# EasyEDA Pro project HandyPico.epro, board PCB1
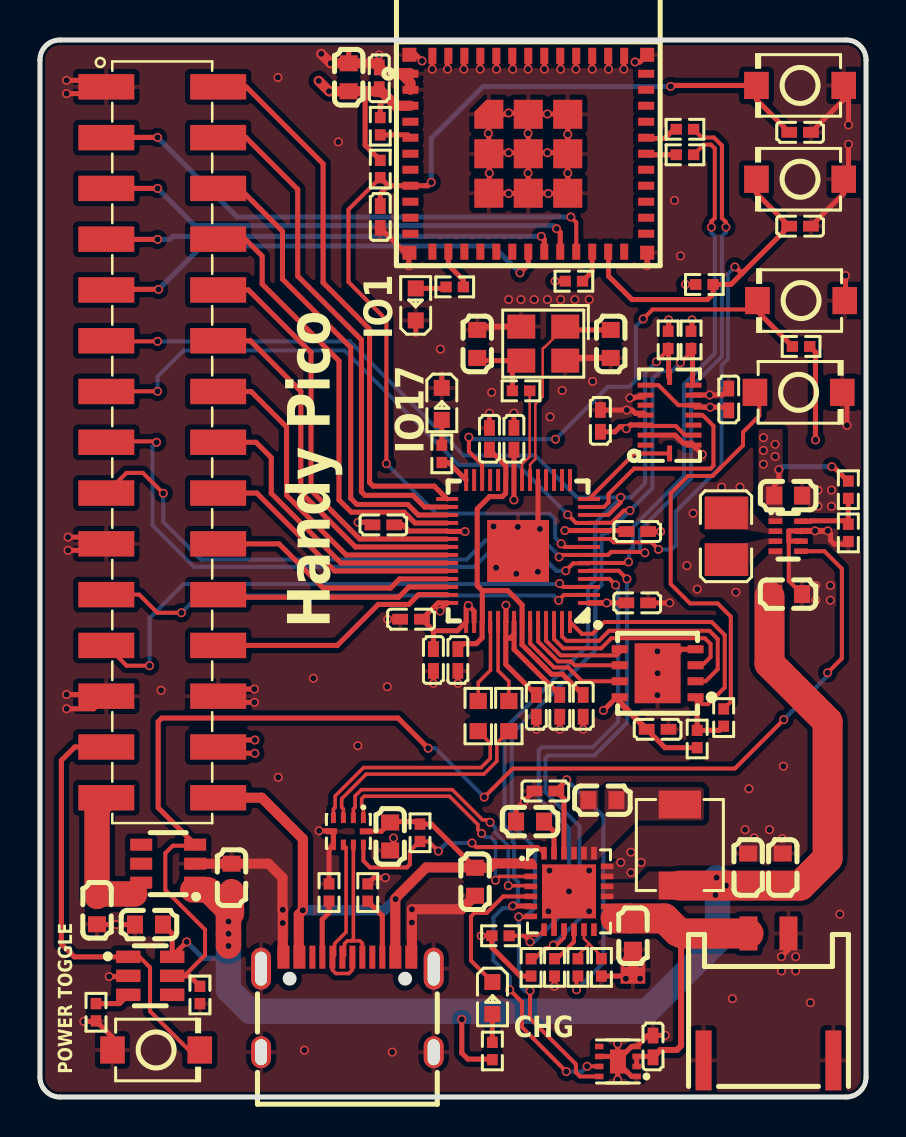
[diagram p1: board, top side]
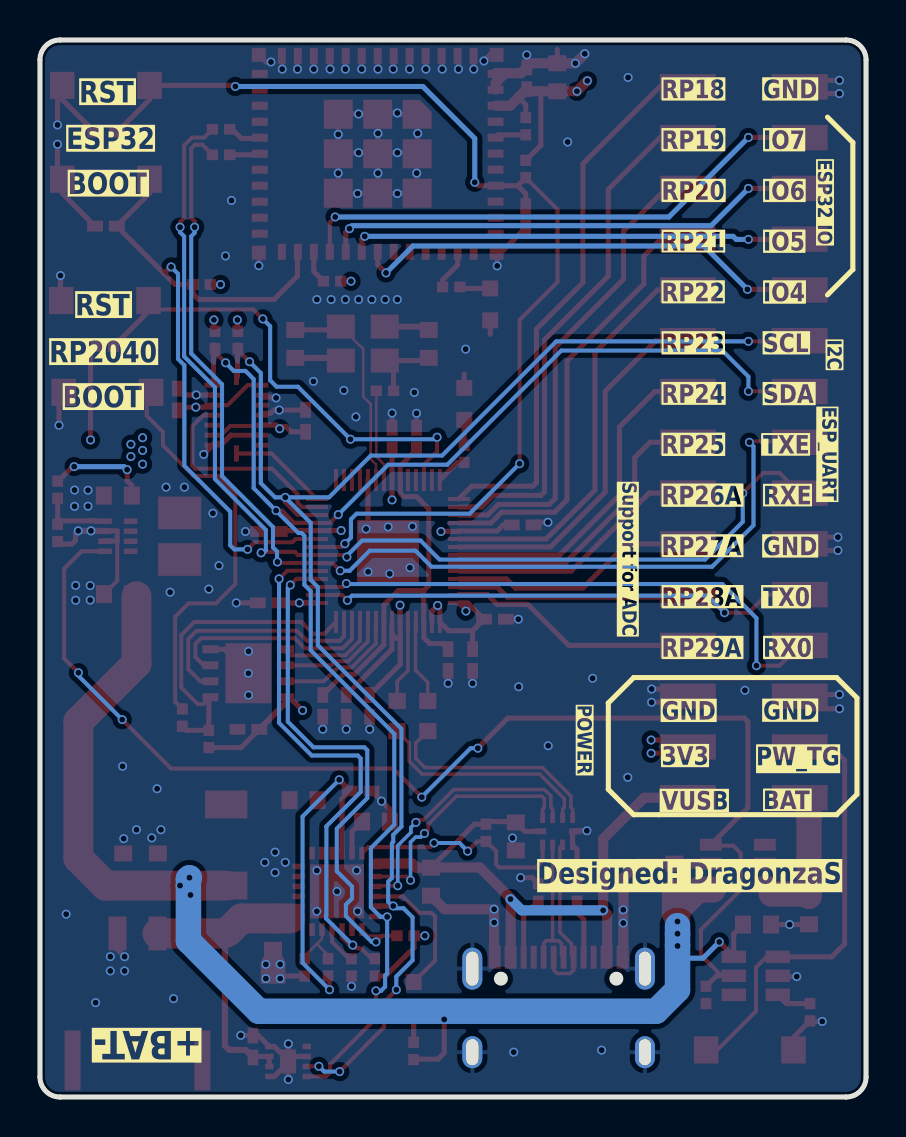
[diagram p2: board, bottom side, seen from below]

Outline 41.35 x 52.87 mm; copper layers: Top Layer, Inner1, Inner2, Bottom Layer. Coordinates in mm from the lower left corner of the outline.
Outline path: 0,51.87 0,1 arc(0.29,0.29) 1,0 40.35,0 arc(41.06,0.29) 41.35,1 41.35,51.87 arc(41.06,52.58) 40.35,52.87 1,52.87 arc(0.29,52.58) 0,51.87
Stack: Top Layer 0.035mm Outer layer thickness 1oz / Dielectric1 0.2104mm 7628 RC49% 8.6mil / Inner1 0.0152mm Inner layer thickness / Dielectric2 1.065mm 1.1mm H/HOZ Copper / Inner2 0.0152mm Inner layer thickness / Dielectric3 0.2104mm 7628 RC49% 8.6mil / Bottom Layer 0.035mm Outer layer thickness 1oz

## Design rules (mm)
template: Custom Config
spacing copperThickness1oz (default): track to track 0.102, other pairs 0.15 to 0.3
spacing copperThickness2oz: track to track 0.203, other pairs 0.152 to 0.3
spacing copperThicknessInner0.5oz: track to track 0.089, other pairs 0.152 to 0.3
track width copperThickness1oz (default): min 0.102, default 0.254, max 2.54
track width copperThickness2oz: min 0.203, default 0.254, max 2.54
track width copperThickness0.5oz: min 0.089, default 0.254, max 2.54
differential pair differentialPair (default): width min 0.127, default 0.254, max 2.54; gap min 0.152, default 0.152
via viaSize (default): diameter min 0.4, default 0.61, max 10; hole min 0.3, default 0.305, max 6.3

## Placement (name value [footprint] x y rotation side)
C1  4.7uF  [C0402]  25.3 15.31 0 top
C2  100nF  [C0402]  38.05 48.25 0 top
C3  100nF  [C0402]  38.05 43.56 0 top
C4  47nF  [C0603]  28.15 14.85 0 top
C5  10uF  [C0603]  35.45 11.48 270 top
C6  10uF  [C0603]  37.18 11.48 270 top
C7  22uF  [C0603]  15.45 51.01 270 top
C8  100nF  [C0402]  16.98 50.96 270 top
C9  1uF  [C0603]  21.78 10.77 90 top
C10  22uF  [C0603]  24.53 13.78 0 top
C12  10uF  [C0603]  29.68 8.06 90 top
C14  100nF  [C0402]  30.69 2.53 270 top
C15  22uF  [C0603]  37.44 25.16 180 top
C16  47uF  [C0603]  37.45 30.08 180 top
C17  10uF  [C0603]  5.46 8.63 180 top
C18  10uF  [C0603]  9.59 10.97 90 top
C19  10uF  [C0603]  17.53 13.03 90 top
C20  1uF  [C0603]  2.86 9.34 90 top
C21  100nF  [C0402]  23.72 32.93 270 top
C22  100nF  [C0402]  18.57 23.9 0 top
C23  100nF  [C0402]  17.19 28.62 0 top
C24  100nF  [C0402]  29.89 28.29 180 top
C25  100nF  [C0402]  29.89 24.72 180 top
C26  100nF  [C0402]  26.02 19.56 90 top
C27  100nF  [C0402]  24.85 19.56 90 top
C28  100nF  [C0402]  27.19 19.56 90 top
C29  100nF  [C0402]  22.5 32.93 270 top
C30  1uF  [C0402]  19.69 21.86 90 top
C31  1uF  [C0402]  20.92 21.86 90 top
C32  100nF  [C0402]  30.91 18.39 180 top
C33  100nF  [C0402]  28.05 33.82 270 top
C34  100nF  [C0402]  34.48 34.89 270 top
C35  15pF  [C0603]  28.57 37.67 270 top
C36  15pF  [C0603]  21.89 37.67 270 top
C37  1uF  [C0402]  17.03 44.02 90 top
CN1  PH-2P卧贴  [CONN-SMD_2P-P2.00_PH2.0-SPWB]  36.47 5 180 top
L1  1.5uH  [IND-SMD_L4.4-W4.2]  32.03 12.6 90 top
L2  1uH  [L1008]  34.35 28.05 90 top
LED1  KT-0603R  [LED0603-RD]  22.64 4.95 270 top
LED2  KT-0603R  [LED0603-RD]  18.81 39.65 90 top
LED3  KT-0603R  [LED0603-RD]  20.11 34.67 270 top
NOREF  -  [Pad_e210]  29.68 6.36 0 top
R1  330Ω  [R0402]  22.64 2.3 90 top
R2  10kΩ  [R0402]  26.93 6.48 270 top
R3  10kΩ  [R0402]  28.1 6.48 90 top
R7  10kΩ  [R0402]  23.05 8.06 180 top
R8  10kΩ  [R0402]  24.58 6.48 270 top
R9  470Ω  [R0402]  25.76 6.48 90 top
R11  511kΩ  [R0402]  40.46 30.38 90 top
R12  91kΩ  [R0402]  40.46 28.22 90 top
R13  10kΩ  [R0402]  19.02 13.22 270 top
R14  5.1kΩ  [R0402]  16.41 10.23 90 top
R15  10kΩ  [R0402]  2.8 4.24 90 top
R16  5.1kΩ  [R0402]  14.47 10.23 90 top
R17  4.7kΩ  [R0402]  31.44 37.87 90 top
R18  4.7kΩ  [R0402]  32.59 37.87 90 top
R19  27Ω  [R0603]  23.47 19.05 270 top
R20  27Ω  [R0603]  21.94 19.05 270 top
R21  1kΩ  [R0402]  34.22 18.98 270 top
R22  10kΩ  [R0402]  32.9 17.91 90 top
R23  10kΩ  [R0402]  38.1 37.54 0 top
R24  1kΩ  [R0402]  24.08 35.32 180 top
R25  5.1kΩ  [R0402]  8.01 5.11 90 top
R26  10kΩ  [R0402]  17.03 46.42 90 top
R27  10kΩ  [R0402]  33.26 40.64 0 top
R28  330Ω  [R0402]  32.28 48.41 0 top
R29  330Ω  [R0402]  32.28 47.13 0 top
R30  10kΩ  [R0402]  17.03 48.56 270 top
R31  10kΩ  [R0402]  26.72 40.81 0 top
R32  330Ω  [R0402]  20.76 40.52 180 top
R33  330Ω  [R0402]  20.12 32.17 90 top
SW1  TS-1088-AR02016  [SW-SMD_L3.9-W3.0-P4.45]  38.05 50.6 180 top
SW2  TS-1088-AR02016  [SW-SMD_L3.9-W3.0-P4.45]  38.05 45.91 180 top
SW3  TS-1088-AR02016  [SW-SMD_L3.9-W3.0-P4.45]  37.97 35.25 0 top
SW4  TS-1088-AR02016  [SW-SMD_L3.9-W3.0-P4.45]  38.1 39.84 180 top
SW5  TS-1088-AR02016  [SW-SMD_L3.9-W3.0-P4.45]  5.81 2.35 0 top
U1  BQ25895RTWR  [QFN-24_L4.0-W4.0-P0.50-TL-EP2.7]  26.48 10.28 0 top
U3  MAX17048G+T10  [TDFN-8_L2.0-W2.0-P0.50-BL-EP1.2]  28.93 1.78 90 top
U4  TPS631000DRLR  [SOT-583-8_L2.1-W1.2-P0.50-LS1.6-BL]  37.45 28.05 270 top
U5  MAX16054AZT+T  [TSOT-23-6_L2.9-W1.6-P0.95-LS2.8-TL]  5.52 6.06 0 top
U6  TPS22918DBVR  [SOT-23-6_L2.9-W1.6-P0.95-LS2.8-BR]  6.42 11.67 0 top
U9  RP2040  [LQFN-56_L7.0-W7.0-P0.4-EP]  23.93 27.31 180 top
U10  W25Q64JVXGIQ  [XSON-8_L4.0-W4.0-P0.80-TL-EP]  30.91 21.2 180 top
U11  BMI088  [LGA-16_L4.5-W3.0-P0.50-BL]  31.51 34.11 0 top
U12  ABM8-272-T3  [CRYSTAL-SMD_4P-L3.2-W2.5-BL]  25.19 37.68 180 top
U14  TS3USB221ARSER  [UQFN-10_L2.0-W1.5-P0.50-BL]  15.44 13.29 180 top
U15  ESP32-C3-MINI-1-N4  [WIFIM-SMD_ESP32-C3-MINI-1]  24.44 47.18 0 top
U17  HB-PH9-254215PB2GOP  [HDR-SMD_30P-P2.54-V-M-R2-C15-S7.4]  6.12 32.75 270 top
USB1  HC-TYPE-C-16P-01A-R  [USB-C-SMD_G-SWITCH_GT-USB-7010EN]  15.39 4.62 0 top

## Footprints (pads in the part's own frame, mm; a bottom-side part is the same pattern mirrored in y, then rotated)
C0402
  rect 0.79x0.54 smd: 1(-0.545,0) 2(0.545,0)
C0603
  rect 0.8x0.9 smd: 1(-0.7,0) 2(0.7,0)
CONN-SMD_2P-P2.00_PH2.0-SPWB
  rect 0.9x1.7 smd: 1(1,-3.175) 2(-1,-3.175)
  rect 0.8x3 smd: 3(-3.25,3.175) 4(3.25,3.175)
CRYSTAL-SMD_4P-L3.2-W2.5-BL
  rect 1.4x1.2 smd: 1(-1.1,-0.85) 2(1.1,-0.85) 3(1.1,0.85) 4(-1.1,0.85)
HDR-SMD_30P-P2.54-V-M-R2-C15-S7.4
  rect 1.27x2.8 smd: 1(-17.78,-2.8) 2(-17.78,2.8) 3(-15.24,-2.8) 4(-15.24,2.8) 5(-12.7,-2.8) 6(-12.7,2.8) 7(-10.16,-2.8) 8(-10.16,2.8) 9(-7.62,-2.8) 10(-7.62,2.8) 11(-5.08,-2.8) 12(-5.08,2.8) 13(-2.54,-2.8) 14(-2.54,2.8) 15(0,-2.8) 16(0,2.8) 17(2.54,-2.8) 18(2.54,2.8) 19(5.08,-2.8) 20(5.08,2.8) 21(7.62,-2.8) 22(7.62,2.8) 23(10.16,-2.8) 24(10.16,2.8) 25(12.7,-2.8) 26(12.7,2.8) 27(15.24,-2.8) 28(15.24,2.8) 29(17.78,-2.8) 30(17.78,2.8)
IND-SMD_L4.4-W4.2
  rect 1.4x2.12 smd: 1(2.028,0) 2(-2.028,0)
L1008
  rect 1.635x2.16 smd: 1(-1.167,0) 2(1.167,0)
LED0603-RD
  rect 0.8x0.8 smd: 1(-0.799,0) 2(0.799,0)
LGA-16_L4.5-W3.0-P0.50-BL
  rect 0.8x0.25 smd: 1(-1.2,-1.498) 2(-1.2,-0.998) 3(-1.2,-0.498) 4(-1.2,0.002) 5(-1.2,0.502) 6(-1.2,1.002) 7(-1.2,1.502) 9(1.2,1.502) 10(1.2,1.002) 11(1.2,0.502) 12(1.2,0.002) 13(1.2,-0.498) 14(1.2,-0.998) 15(1.2,-1.498)
  rect 0.25x0.8 smd: 8(0,1.915) 16(0,-1.915)
LQFN-56_L7.0-W7.0-P0.4-EP
  rect 1.1x0.2 smd: 1(-3.55,2.6) 2(-3.55,2.2) 3(-3.55,1.8) 4(-3.55,1.4) 5(-3.55,1) 6(-3.55,0.6) 7(-3.55,0.2) 8(-3.55,-0.2) 9(-3.55,-0.6) 10(-3.55,-1) 11(-3.55,-1.4) 12(-3.55,-1.8) 13(-3.55,-2.2) 14(-3.55,-2.6) 29(3.55,-2.6) 30(3.55,-2.2) 31(3.55,-1.8) 32(3.55,-1.4) 33(3.55,-1) 34(3.55,-0.6) 35(3.55,-0.2) 36(3.55,0.2) 37(3.55,0.6) 38(3.55,1) 39(3.55,1.4) 40(3.55,1.8) 41(3.55,2.2) 42(3.55,2.6)
  rect 0.2x1.1 smd: 15(-2.6,-3.55) 16(-2.2,-3.55) 17(-1.8,-3.55) 18(-1.4,-3.55) 19(-1,-3.55) 20(-0.6,-3.55) 21(-0.2,-3.55) 22(0.2,-3.55) 23(0.6,-3.55) 24(1,-3.55) 25(1.4,-3.55) 26(1.8,-3.55) 27(2.2,-3.55) 28(2.6,-3.55) 43(2.6,3.55) 44(2.2,3.55) 45(1.8,3.55) 46(1.4,3.55) 47(1,3.55) 48(0.6,3.55) 49(0.2,3.55) 50(-0.2,3.55) 51(-0.6,3.55) 52(-1,3.55) 53(-1.4,3.55) 54(-1.8,3.55) 55(-2.2,3.55) 56(-2.6,3.55)
  rect 3.1x3.1 smd: 57(0,0)
Pad_e210
  custom 1.239x1.377 smd: 69(0,0)
QFN-24_L4.0-W4.0-P0.50-TL-EP2.7
  rect 0.633x0.28 smd: 1(-1.911,1.25) 2(-1.911,0.75) 3(-1.911,0.25) 4(-1.911,-0.25) 5(-1.911,-0.75) 6(-1.911,-1.25) 13(1.911,-1.25) 14(1.911,-0.75) 15(1.911,-0.25) 16(1.911,0.25) 17(1.911,0.75) 18(1.911,1.25)
  rect 0.28x0.633 smd: 7(-1.25,-1.911) 8(-0.75,-1.911) 9(-0.25,-1.911) 10(0.25,-1.911) 11(0.75,-1.911) 12(1.25,-1.911) 19(1.25,1.911) 20(0.75,1.911) 21(0.25,1.911) 22(-0.25,1.911) 23(-0.75,1.911) 24(-1.25,1.911)
  rect 2.7x2.7 smd: 25(0,0)
R0402
  rect 0.566x0.54 smd: 1(-0.433,0) 2(0.433,0)
R0603
  rect 0.806x0.864 smd: 1(-0.753,0) 2(0.753,0)
SOT-23-6_L2.9-W1.6-P0.95-LS2.8-BR
  rect 1.1x0.6 smd: 1(1.35,-0.95) 2(1.35,0) 3(1.35,0.95) 4(-1.35,0.95) 5(-1.35,0) 6(-1.35,-0.95)
SOT-583-8_L2.1-W1.2-P0.50-LS1.6-BL
  rect 0.28x0.68 smd: 1(-0.75,-0.64) 2(-0.25,-0.64) 3(0.25,-0.64) 4(0.75,-0.64) 5(0.75,0.64) 6(0.25,0.64) 7(-0.25,0.64) 8(-0.75,0.64)
SW-SMD_L3.9-W3.0-P4.45
  rect 1.23x1.36 smd: 1(-2.185,0) 2(2.185,0)
TDFN-8_L2.0-W2.0-P0.50-BL-EP1.2
  rect 0.28x0.425 smd: 1(-0.75,-0.938) 2(-0.25,-0.938) 3(0.25,-0.938) 4(0.75,-0.938) 5(0.75,0.938) 6(0.25,0.938) 7(-0.25,0.938) 8(-0.75,0.938)
  rect 1.2x0.8 smd: 9(0,0)
TSOT-23-6_L2.9-W1.6-P0.95-LS2.8-TL
  rect 1.219x0.623 smd: 1(-1.1,0.95) 2(-1.1,0) 3(-1.1,-0.95) 4(1.1,-0.95) 5(1.1,0) 6(1.1,0.95)
UQFN-10_L2.0-W1.5-P0.50-BL
  rect 0.25x0.525 smd: 1(-0.75,-0.675) 2(-0.25,-0.675) 3(0.25,-0.675) 4(0.75,-0.675) 6(0.75,0.675) 7(0.25,0.675) 8(-0.25,0.675) 9(-0.75,0.675)
  rect 0.58x0.3 smd: 5(0.86,0) 10(-0.86,0)
USB-C-SMD_G-SWITCH_GT-USB-7010EN
  oval 1x2.1 hole 0.6x1.7: 1(-4.32,1.802) 2(4.32,1.802)
  oval 1x1.6 hole 0.6x1.3: 3(4.32,-2.377) 4(-4.32,-2.377)
  rect 0.6x1.15 smd: A1B12(-3.2,2.377) A4B9(-2.4,2.377) B1A12(3.2,2.377) B4A9(2.4,2.377)
  rect 0.3x1.15 smd: A5(-1.25,2.377) A6(-0.25,2.377) A7(0.25,2.377) A8(1.25,2.377) B5(1.75,2.377) B6(0.75,2.377) B7(-0.75,2.377) B8(-1.75,2.377)
WIFIM-SMD_ESP32-C3-MINI-1
  rect 0.8x0.4 smd: 1(-5.9,4) 2(-5.9,3.2) 3(-5.9,2.4) 4(-5.9,1.6) 5(-5.9,0.8) 6(-5.9,0) 7(-5.9,-0.8) 8(-5.9,-1.6) 9(-5.9,-2.4) 10(-5.9,-3.2) 11(-5.9,-4) 25(5.9,-4) 26(5.9,-3.2) 27(5.9,-2.4) 28(5.9,-1.6) 29(5.9,-0.8) 30(5.9,0) 31(5.9,0.8) 32(5.9,1.6) 33(5.9,2.4) 34(5.9,3.2) 35(5.9,4)
  rect 0.4x0.8 smd: 12(-4.8,-4.9) 13(-4,-4.9) 14(-3.2,-4.9) 15(-2.4,-4.9) 16(-1.6,-4.9) 17(-0.8,-4.9) 18(0,-4.9) 19(0.8,-4.9) 20(1.6,-4.9) 21(2.4,-4.9) 22(3.2,-4.9) 23(4,-4.9) 24(4.8,-4.9) 36(4.8,4.9) 37(4,4.9) 38(3.2,4.9) 39(2.4,4.9) 40(1.6,4.9) 41(0.8,4.9) 42(0,4.9) 43(-0.8,4.9) 44(-1.6,4.9) 45(-2.4,4.9) 46(-3.2,4.9) 47(-4,4.9) 48(-4.8,4.9)
  custom 1.45x1.45 smd: 49(-1.975,1.975)
  rect 1.45x1.45 smd: 49(-1.975,0) 49(-1.975,-1.975) 49(0,1.975) 49(0,0) 49(0,-1.975) 49(1.975,1.975) 49(1.975,0) 49(1.975,-1.975)
  rect 0.7x0.7 smd: 50(5.95,4.95) 51(5.95,-4.95) 52(-5.95,-4.95) 53(-5.95,4.95)
XSON-8_L4.0-W4.0-P0.80-TL-EP
  rect 0.8x0.4 smd: 1(-1.9,1.2) 2(-1.9,0.4) 3(-1.9,-0.4) 4(-1.9,-1.2) 5(1.9,-1.2) 6(1.9,-0.4) 7(1.9,0.4) 8(1.9,1.2)
  rect 2.3x3 smd: 9(0,0)

## Nets
As in the schematic, except:
GND: C1.1 C2.2 C3.2 C5.1 C6.1 C7.1 C8.1 C9.1 C10.1 C12.1 C14.1 C15.1 C16.1 C17.2 C18.2 C19.1 C20.1 C21.1 C22.1 C23.1 C24.1 C25.1 C26.1 C27.1 C28.1 C29.1 C30.1 C31.1 C32.1 C33.1 C34.1 C35.2 C36.1 C37.1 CN1.2 CN1.3 CN1.4 LED2.1 LED3.1 NOREF.69 R3.1 R9.1 R12.1 R14.2 R15.1 R16.2 R25.1 SW1.1 SW2.1 SW3.2 SW4.1 SW5.1 U1.8 U1.17 U1.18 U1.25 U3.1 U3.4 U3.6 U3.9 U4.6 U4.7 U5.2 U6.2 U9.19 U9.57 U10.4 U10.9 U11.2 U11.4 U11.6 U11.10 U11.15 U12.2 U12.4 U14.5 U14.6 U15.1 U15.2 U15.36 U15.37 U15.38 U15.39 U15.40 U15.41 U15.42 U15.43 U15.44 U15.45 U15.46 U15.47 U15.48 U15.49 U15.50 U15.51 U15.52 U15.53 U17.1 U17.19 U17.25 U17.26 USB1.1 USB1.2 USB1.3 USB1.4 USB1.A1B12 USB1.B1A12

Pads without a net: U1 12; U3 5; U5 4; U6 4 5; U9 15 16 17 18 24 25 27; U11 1 5 13; U15 4 6 7 9 10 11 12 14 15 16 17 24 25 26 27 28 29 32 33 34 35; USB1 A8 B8

## Via types
v1: diameter 0.45, hole 0.3, Top Layer to Bottom Layer, 243 vias

## Routing (per net, layer and track width the routed paths; a pad name or vN(x,y) marks a point on that pad's centre or on a via; arc(x,y) is an arc through that point)
1V1: length 20.6
  Top Layer w0.254: C31.2 21.19,22.68 21.84,22.68 22.13,22.97 U9.45 22.14,23.78 22.14,25.33 ; 23.32,30.92 23.32,31.57 C29.2 ; 23.31,30.84 23.31,30.2 23.15,30.03 22.5,30.03 21.89,29.42 21.89,25.58 22.14,25.33 23.42,25.33 24.13,24.61 24.13,23.76 ; U9.50 24.13,22.63 25.61,21.15 26.16,21.15 C28.2
3V3: length 74.6
  Top Layer w0.203: U11.14 32.28,33.11 31.82,33.57 30.36,33.57 U11.3 ; U11.7 30.96,35.61 31.96,34.61 U11.11
  Top Layer w0.254: C30.2 19.69,23.32 ; 19.69,23.32 C22.2 19.93,24.71 U9.42 20.03,24.36 v1(20.03,24.31) ; 19.69,23.32 20.89,23.32 U9.43 21.33,24.48 v1(21.44,24.59) 21.73,24.3 U9.44 ; C27.2 23.32,21.64 23.32,22.95 ; 23.32,22.95 23.32,23.75 U9.48 23.32,23.77 v1(23.32,24.6) ; 23.32,22.95 23.53,22.95 23.73,23.15 ; 16.28,50.31 16.28,47.61 R26.2 ; 23.73,23.15 23.73,22.4 C26.2 ; 23.73,23.15 U9.49 ; v1(28.36,24.72) C25.2 ; v1(28.36,24.72) 28.36,24.71 U9.1 27.48,24.72 v1(28.36,24.72) ; v1(39.64,31.53) 39.71,31.53 40.35,30.89 ; v1(31.47,38.87) 31.47,38.49 ; U11.3 30.31,33.62 29.59,33.62 29.58,33.6 29.52,33.6 v1(29.35,33.43) 29.25,33.53 29.03,33.53 28.78,33.28 C33.2 ; U10.8 28.86,20 v1(28.2,19.34) ; U11.11 32.81,34.51 33.23,34.51 33.24,34.51 v1(33.55,34.51) 34.32,34.51 C34.2 ; R30.1 17.03,49.64 17.4,50 ; v1(32.31,40.64) R27.1 ; v1(25.78,40.81) R31.1 ; 36.75,30.59 36.99,30.83 v1(36.99,31.38) ; R8.2 24.05,6.05 22.62,7.48 R7.2 v1(22.08,8.06) ; v1(21.28,28.29) 21.05,28.29 21.05,28.29 20.4,28.29 U9.33 18.46,28.31 18.16,28.62 C23.2 ; v1(23.72,29.87) 23.72,30.86 ; R22.1 31.29,17.48 C32.2 ; v1(38.82,32.87) 38.82,37.26 R23.2 ; 27.46,28.33 26.81,28.33 26.81,28.34 v1(26.27,28.34) ; v1(32.64,38.87) 32.64,38.49 ; C21.2 23.72,30.87 ; v1(10.76,17.86) 9.27,17.86 U17.28 9.24,17.19 v1(10.76,17.19) ; 27.5,28.33 29.3,28.33 C24.2
  Top Layer w0.305: C32.2 29.01,19.75 U10.8
  Top Layer w0.508: U15.3 17.81,49.58 C8.2 16.88,50.31 C7.2 v1(14.47,50.31) v1(13.95,50.83)
  Bottom Layer w0.254: v1(39.64,31.53) 37.14,31.53 v1(36.99,31.38)
  vias: v1(36.21,32.98) v1(36.21,32.34) v1(36.21,31.65) v1(36.8,32.65) v1(36.8,32.04)
GND: length 150.8
  Top Layer w0.203: C15.1 37.48,25.82 37.48,27.81
  Top Layer w0.254: U5.2 4.38,6.02 v1(3.47,6.02) ; v1(13.97,13.32) 14.55,13.32 U14.5 14.69,13.18 U14.6 14.47,12.39 R16.2 ; v1(24.85,18.4) C27.1 ; v1(28.92,0.87) 28.92,1.77 U3.9 ; v1(28.92,2.66) 28.92,1.79 ; 28.92,1.79 U3.9 ; 28.92,1.79 28.68,2.03 U3.6 ; v1(40.39,33.6) 40.39,35.14 40.28,35.25 ; v1(15.92,28.75) 16.51,28.75 C23.1 ; U15.49 24.39,47.23 v1(23.46,47.23) 22.52,47.23 22.47,47.18 ; U15.49 24.44,48.19 v1(24.43,48.2) 24.43,49.14 24.44,49.16 ; U15.49 24.44,46.23 v1(24.43,46.21) 24.44,46.2 U15.49 ; U15.49 24.49,47.23 v1(25.4,47.23) 26.37,47.23 U15.49 v1(26.42,46.21) 26.42,45.21 ; R3.1 29.38,6.05 NOREF.69 ; v1(23.66,51.42) 23.66,52.06 U15.43 ; U15.49 25.44,45.21 v1(25.45,45.19) 26.4,45.19 U15.49 ; U15.49 24.43,45.19 v1(23.46,45.19) 23.45,45.21 22.47,45.21 22.49,45.23 v1(22.49,46.21) 22.49,47.16 22.47,47.18 ; 18.81,38.16 18.81,38.16 LED2.1 ; v1(26.02,18.4) C26.1 ; C34.1 34.16,35.12 v1(33.52,35.12) 32.72,35.12 U11.10 ; v1(16.98,52.13) C8.1 ; v1(28.46,51.42) 28.46,52.07 U15.37 ; v1(40.32,41.09) 40.32,39.88 SW4.1 ; U15.41 25.25,52.08 v1(25.25,51.42) ; v1(24.25,14.8) 23.84,14.39 23.83,14.39 ; v1(27.64,51.42) U15.38 ; v1(19.64,51.42) 19.64,52.08 U15.48 ; v1(1.41,28.01) 2.98,28.01 U17.19 2.99,27.34 v1(1.41,27.34) ; 23.83,14.39 C10.1 ; 23.83,14.39 C1.1 ; v1(25.76,5.54) R9.1 ; C20.1 2.87,8.63 v1(3.82,8.63) C17.2 ; R14.2 16.72,10.97 v1(17.29,10.97) ; C19.1 17.7,12.5 v1(17.7,12.96) ; v1(21.22,51.42) 21.22,52.06 U15.46 ; U3.9 28.93,1.84 29.61,2.53 U3.4 30.41,3.07 C14.1 30.7,3.08 v1(31.3,3.08) ; U3.9 29.18,1.52 29.18,1.46 29.62,1.03 29.87,1.03 ; SW5.1 3.63,2.98 R15.1 2.78,3.78 v1(2.19,3.78) ; CN1.2 37.47,7.37 v1(37.11,7.02) ; U9.19 24.93,28.31 U9.57 ; 15.45,52.4 15.45,51.71 ; U15.40 26.06,52.06 v1(26.06,51.42) ; U11.2 31.79,33.11 32.2,32.7 32.62,32.7 U11.15 ; U10.4 32.11,22.4 v1(30.91,21.2) ; LED3.1 20.11,35.47 20.11,36.16 ; v1(1.33,50.19) 2.98,50.19 U17.1 2.99,50.85 v1(1.33,50.85) ; U15.44 22.85,52.08 v1(22.85,51.42) ; C2.2 40.23,49.89 SW1.1 40.47,50.36 v1(40.47,48.62) ; v1(27.19,18.4) C28.1 ; C37.1 18.28,42.23 U15.52 18.46,42.2 v1(18.46,41.57) ; v1(26.48,10.28) 25.73,9.53 U1.8 ; C33.1 28.05,34.36 v1(29.37,34.36) 29.64,34.36 29.8,34.2 30.22,34.2 U11.4 ; U15.47 20.4,52.04 v1(20.4,51.42) ; v1(19.13,51.82) 18.82,52.13 U15.53 ; v1(31.52,24.72) C25.1 ; v1(24.43,51.42) 24.43,52.07 U15.42 ; v1(1.33,19.42) 2.69,19.42 U17.25 3.24,20.13 v1(1.33,20.13) ; v1(10.73,20.41) 9.28,20.41 U17.26 9.23,19.74 v1(10.73,19.74) ; 22.47,47.18 22.47,48.18 v1(22.44,48.2) 22.47,48.23 22.47,49.16 23.4,49.16 v1(23.46,49.22) 24.38,49.22 24.44,49.16 ; R12.1 40.33,27.66 39.75,27.66 39.57,27.84 39.57,28.18 v1(39.43,28.32) ; 26.42,49.16 26.4,49.17 v1(25.4,49.17) 24.46,49.17 24.44,49.16 ; U15.45 22.03,52.07 v1(22.03,51.42) ; U15.39 26.83,52.07 v1(26.83,51.42) ; v1(30.39,41.58) U15.51 ; 26.42,47.18 v1(26.42,48.15) U15.49 ; v1(33.15,32.14) 32.59,32.7 ; U4.7 38.07,28.32 37.48,28.32 37.48,27.81 38.08,27.81 U4.6 ; v1(17.4,23.9) C22.1 ; v1(29.78,51.77) 30.03,51.77 U15.50 ; U11.6 30.22,35.01 29.8,35.01 29.76,34.97 v1(29.53,34.97) ; C3.2 40.23,45.2 SW2.1 40.47,46.15 v1(40.47,47.66) ; v1(19.69,20.69) C30.1 ; v1(20.92,20.69) C31.1 ; v1(29.22,51.42) 29.22,52.06 U15.36 ; v1(31.06,28.29) C24.1 ; C29.1 v1(22.5,34.2) ; C21.1 v1(23.72,34.21)
  Top Layer w0.305: U4.7 38.11,28.32 v1(38.8,28.32) v1(39.43,28.32) ; C35.2 26.43,36.97 26.29,36.83 ; U12.2 22.05,38.53 C36.1
  Top Layer w0.508: 18.06,51.21 18.51,51.21 U15.1 ; 18.06,51.21 18.54,50.73 U15.2 ; 18.06,51.21 17.27,51.21 C8.1 16.78,51.71 C7.1 v1(14.55,51.71) v1(14.08,52.18) ; 7.51,11.62 7.56,11.67 C18.2 11.44,11.67 12.14,10.97 12.14,9.38 v1(12.15,9.36) v1(12.15,8.7) 12.15,7 12.12,6.97 ; USB1.B1A12 18.62,7.02 v1(18.62,8.73) v1(18.62,9.39) 21.1,9.39 C9.1
  vias: v1(6.06,20.35) v1(11.91,51) v1(11.93,15.99) v1(13.23,2.34) v1(13.68,20.95) v1(14.94,47.77) v1(15.91,17.57) v1(17.39,20.52) v1(17.64,2.24) v1(20.04,37.41) v1(22.61,35.25) v1(22.7,28.54) v1(22.83,26.47) v1(23.46,39.89) v1(23.92,28.52) v1(23.84,26.17) v1(24.07,39.89) v1(24.74,39.89) v1(24.92,26.27) v1(25.02,28.41) v1(25.4,39.89) v1(25.54,34.02) v1(25.5,11.33) v1(25.45,9.29) v1(26.06,39.89) v1(26.14,35.35) v1(26.78,39.89) v1(27.49,39.89) v1(27.49,11.33) v1(27.49,9.29) v1(27.66,35.8) v1(29.07,11.74) v1(29.33,6.64) v1(29.33,5.92) v1(29.58,12.25) v1(29.58,11.23) v1(30.04,6.64) v1(30.04,5.92) v1(30.09,11.74) v1(30.91,22.29) v1(30.91,20.1) v1(31.76,44.85) v1(32.06,42.07) v1(32.39,26.58) v1(32.69,29.2) v1(32.9,25.41) v1(34.12,30.51) v1(34.66,4.92) v1(34.83,25.25) v1(35.04,30.51) v1(35.29,13.37) v1(35.49,15.42) v1(35.75,12.96) v1(36.52,13.37) v1(37.11,6.31) v1(37.21,16.54) v1(37.16,12.92) v1(37.83,7.02) v1(37.83,6.31) v1(38.56,4.72) v1(38.83,25.58) v1(38.83,24.86) v1(38.94,30.35) v1(38.94,29.55) v1(39.62,30.36) v1(39.62,29.55) v1(39.56,25.59) v1(39.56,24.85) v1(40.04,9.14)
ACC_INT: length 10.5
  Top Layer w0.203: 27.48,29.51 28.23,29.51 28.46,29.74 28.46,30.16 29.73,31.43 33.57,31.43 33.71,31.58 33.71,33.57 33.17,34.11 U11.12
BAT: length 16.4
  Top Layer w0.254: C14.2 30.64,2.03 U3.3 U3.2 ; C12.2 29.52,8.93 28.91,9.53
  Top Layer w0.305: 32.13,8.18 32.09,8.14 32.09,2.57 31.88,2.35 31.05,2.35 C14.2
  Top Layer w1.5: 28.82,8.93 31.26,8.93 31.93,8.27 ; CN1.1 32.13,8.18
BAT_EXT: length 7.1
  Top Layer w1.27: 4.74,10.16 2.97,10.16 C20.2 2.86,14.51 U17.29
CHG_CE: length 27.2
  Top Layer w0.127: 25.21,7.42 25.25,7.42
  Top Layer w0.203: v1(29.38,25.92) 28.97,26.32 27.49,26.32 U9.5 ; U1.9 26.23,7.98 25.85,7.6 v1(25.69,7.6) 25.55,7.45 25.38,7.45 25.34,7.42 25.25,7.42 24.76,6.92 R8.1
  Bottom Layer w0.203: v1(25.69,7.6) 27.03,8.94 27.03,9.07 27.01,9.09 27.01,13.54 25.3,15.26 25.3,16.94 25.44,17.08 27.74,17.08 29.38,18.72 v1(29.38,25.92)
CHG_D1+: length 12.6
  Top Layer w0.177: 16.19,13.96 16.19,14.4 16.1,14.49 16.1,14.92 16.23,15.04 20.5,15.04 21.92,13.63 21.92,13.37 v1(22.1,13.19) ; v1(22.8,10.84) 22.99,11.03 U1.2
  Bottom Layer w0.177: v1(22.8,10.84) 22.8,12.75 22.55,13 22.29,13 v1(22.1,13.19)
CHG_D1-: length 13.4
  Top Layer w0.177: v1(22.53,13.74) 22.4,13.86 22.15,13.86 20.64,15.37 16.09,15.37 15.77,15.06 15.77,14.49 15.69,14.4 15.69,13.96 ; U1.3 24.53,10.57 v1(23.44,10.57)
  Bottom Layer w0.177: v1(22.53,13.74) 22.78,13.49 22.78,13.23 23.44,12.57 v1(23.44,10.57)
CHG_INT: length 26.6
  Top Layer w0.127: 24.23,8.06 24.92,8.06 U1.7
  Top Layer w0.203: 27.48,25.91 27.48,25.92 28.51,25.92 v1(28.82,25.61) ; v1(24.53,7.76) 24.23,8.06 R7.1
  Bottom Layer w0.203: v1(24.53,7.76) 24.74,7.76 26.04,9.05 26.04,9.62 25.73,9.93 25.73,10.53 26.49,11.29 26.49,13.42 24.96,14.95 24.96,17.35 25.11,17.49 27.66,17.49 28.94,18.78 28.94,25.48 v1(28.82,25.61)
D+: length 7.2
  Top Layer w0.177: U14.8 15.69,7.89 15.6,7.81 ; USB1.B6 16.14,7.69 16.01,7.81 15.6,7.81 ; 15.6,7.81 15.39,7.81 15.25,7.67 15.25,7.11 USB1.A6
D-: length 8.4
  Top Layer w0.177: U14.7 15.32,12.48 15.32,8.25 14.75,7.67 14.75,7.11 USB1.B7 14.64,6.35 14.81,6.18 15.46,6.18 15.64,6.35 USB1.A7
DIS_PW: length 1.8
  Top Layer w0.254: R15.2 3.98,4.67 U5.3
ESP_BOOT: length 35.9
  Top Layer w0.203: 27.48,27.91 28.55,27.91 28.71,27.75 30.6,27.75 v1(30.96,27.39)
  Top Layer w0.254: v1(34.78,41.52) 34.81,41.52 35.13,41.19 ; U15.23 28.46,42.27 28.46,41.06 29.63,39.89 33.41,39.89 33.69,40.17 R27.2 34.58,40.64 35.13,41.19 ; 35.13,41.19 C3.1 35.86,45.2 SW2.2
  Bottom Layer w0.203: v1(34.78,41.52) 34.44,41.18 34.44,36.92 34.12,36.6 34.12,31.58 31.82,29.28 31.82,27.6 31.62,27.39 v1(30.96,27.39)
ESP_EN: length 54.7
  Top Layer w0.203: v1(26.09,27.67) 26.25,27.51 27.48,27.51 ; R26.1 15.44,44.39 15.44,40.77 17.34,38.87 v1(17.34,31.68)
  Top Layer w0.254: C2.1 35.86,49.89 SW1.2 31.62,50.6 v1(31.57,50.55) ; C37.2 17.03,45.18 17.44,45.58 ; R26.1 17.44,45.58 ; 17.44,45.58 U15.8 19.41,45.58 v1(19.58,45.75)
  Bottom Layer w0.203: v1(17.34,31.68) 19.84,29.18 25.5,29.18 25.78,28.9 25.78,27.98 v1(26.09,27.67)
  Bottom Layer w0.254: v1(31.57,50.55) 22.19,50.55 19.58,47.95 v1(19.58,45.75)
ESP_LED: length 2.1
  Top Layer w0.254: R32.1 21.19,40.86 20.44,41.61 U15.13
GPIO18: length 28
  Top Layer w0.254: U17.2 10.32,50.53 14.17,46.68 14.17,40.74 16.5,38.41 16.5,30.74 16.68,30.56 19.74,30.56 20.38,29.91
GPIO19: length 26.1
  Top Layer w0.254: 20.38,29.51 19.25,29.51 18.67,30.1 16.27,30.1 16.09,30.28 16.09,37.88 12.9,41.06 12.9,45.4 10.31,47.99 U17.4
GPIO20: length 24.1
  Top Layer w0.254: U9.31 18.94,29.11 18.41,29.64 15.86,29.64 15.56,29.94 15.56,37.49 12.14,40.91 12.14,43.3 10,45.45 U17.6
GPIO21: length 22.2
  Top Layer w0.254: U17.8 10.27,42.91 11.12,42.06 11.12,40.66 14.97,36.82 14.97,29.87 15.58,29.25 18.24,29.25 18.78,28.71 U9.32
GPIO22: length 20.7
  Top Layer w0.254: 20.38,27.91 16.01,27.91 13.57,30.35 13.57,37.24 10.43,40.37 U17.10
GPIO23: length 18.7
  Top Layer w0.254: U17.12 10.53,37.83 13.06,35.3 13.06,30.25 15.79,27.51 20.38,27.51
GPIO24: length 16.8
  Top Layer w0.254: U17.14 10.57,35.29 12.34,33.51 12.34,30.1 15.33,27.11 U9.36
GPIO25: length 15
  Top Layer w0.254: U9.37 15.06,26.71 11.58,30.2 11.58,31.98 10.81,32.75 U17.16
GPIO26_ADC0: length 13.1
  Top Layer w0.254: U17.18 10.85,30.21 14.75,26.31 U9.38
GPIO27_ADC1: length 12.6
  Top Layer w0.254: 20.38,25.91 18,25.91 17.54,25.46 14.18,25.46 11.97,27.67 U17.20
GPIO28_ADC2: length 11.7
  Top Layer w0.254: U17.22 9.05,25 17.95,25 18.47,25.51 20.38,25.51
GPIO29_ADC3: length 12.5
  Top Layer w0.254: U9.41 20.36,25.13 18.96,25.13 18.46,24.64 16.93,24.64 14.88,22.59 U17.24
GYR_INT: length 4.9
  Top Layer w0.203: 27.48,29.91 29.76,32.19 31.46,32.19
I2C_SCL: length 77.7
  Top Layer w0.203: 31.47,37.39 v1(30.86,36.78) ; v1(29.07,30) 29.07,29.74 28.44,29.11 U9.12 ; v1(26.34,1.27) 24.12,3.49 24.12,4.75 v1(23.51,5.36) ; v1(5.89,37.8) 3.35,37.8 U17.11 ; v1(27.39,1.54) 27.98,1.54 U3.7
  Top Layer w0.254: 31.46,36.02 31.46,37.62 31.47,37.62 ; U1.5 24.55,9.56 v1(23.67,9.56)
  Bottom Layer w0.203: v1(29.07,30) 27.8,28.72 27.8,25.86 27.44,25.51 27.44,22.6 23.26,18.42 23.26,13.52 23.67,13.11 23.67,12.76 23.73,12.69 23.73,10.95 23.92,10.77 23.92,9.77 23.7,9.56 v1(23.67,9.56) 23.55,9.44 23.15,9.44 22.7,8.98 22.7,6.84 23.51,6.02 v1(23.51,5.36) ; v1(29.07,30) 26.88,30 24.79,32.09 21.22,32.09 15.5,37.8 v1(5.89,37.8) ; v1(29.07,30) 29.58,30 30.29,30.71 30.29,36.22 v1(30.86,36.78) ; v1(27.39,1.54) 27.12,1.27 v1(26.34,1.27)
I2C_SDA: length 77.8
  Top Layer w0.203: U1.6 24.54,9.01 v1(23.97,9.01) ; U17.13 3.33,35.3 v1(5.89,35.3) ; v1(24.53,5.31) 24.53,3.93 26.83,1.64 26.83,1.23 27.03,1.03 U3.8 ; 32.64,37.31 v1(32.05,36.73) ; v1(26.42,29.13) 26.83,28.71 U9.11 27.49,28.72 28.61,28.72 29.22,29.33 v1(29.53,29.33)
  Top Layer w0.254: 32.64,37.62 32.66,37.6 32.66,35.61
  Bottom Layer w0.203: v1(5.89,35.3) 5.89,36.04 7.19,37.34 15.25,37.34 20.96,31.63 23.92,31.63 v1(26.42,29.13) ; 31.07,36.32 31.65,36.32 v1(32.05,36.73) ; 31.06,36.32 30.65,35.91 30.65,30.45 v1(29.53,29.33) 28.41,28.21 28.25,28.21 28.11,28.07 28.11,25.62 27.8,25.3 27.8,22.35 23.61,18.16 23.61,13.62 24.79,12.45 24.79,9.49 24.3,9.01 v1(23.97,9.01) 23.97,6.18 24.07,6.08 24.07,5.51 24.28,5.31 v1(24.53,5.31)
IO4: length 23.4
  Top Layer w0.254: U15.18 24.44,41.64 v1(24.03,41.22) ; v1(5.94,40.4) 3.35,40.4 U17.9
  Bottom Layer w0.254: v1(24.03,41.22) 22.68,42.57 8.11,42.57 v1(5.94,40.4)
IO5: length 22.7
  Top Layer w0.254: U17.7 3.33,42.9 v1(5.89,42.9) ; U15.19 25.24,42.9 v1(25.09,43.05)
  Bottom Layer w0.254: v1(5.89,42.9) 6.5,42.9 6.65,43.05 v1(25.09,43.05)
IO6: length 24.6
  Top Layer w0.254: U15.20 26.04,43.25 v1(25.86,43.43) ; v1(5.89,45.45) 3.32,45.45
  Bottom Layer w0.254: v1(25.86,43.43) 25.86,43.46 25.73,43.58 7.75,43.58 v1(5.89,45.45)
IO7: length 26.8
  Top Layer w0.203: U15.21 26.84,43.75 v1(26.57,44.02)
  Top Layer w0.254: v1(5.89,48) 3.33,48 U17.3
  Bottom Layer w0.254: v1(26.57,44.02) 26.57,44.02 9.87,44.02 v1(5.89,48)
PMID: length 1.8
  Top Layer w0.254: C10.2 25.73,13.28 U1.23
PW_EN: length 63.1
  Top Layer w0.203: v1(22.24,15) 23.66,16.43 34.78,16.43 v1(37.23,18.88) ; v1(39.42,21.22) 40.14,21.94 40.14,26.43 39.26,27.3 U4.5 ; 7.51,12.57 6.65,12.57 6.27,12.2 6.27,10.36 8.26,8.37 8.26,7.1 7.23,6.06
  Top Layer w0.254: v1(19.43,17.45) 17.93,18.95 6.1,18.95 5.92,18.78 5.92,14.47 U6.3 ; R25.2 7.49,6.06 6.62,6.06
  Bottom Layer w0.203: v1(37.23,18.88) 39.42,21.07 v1(39.42,21.22) ; v1(22.24,15) 19.79,17.45 v1(19.43,17.45)
PW_TOGGLE: length 22.1
  Top Layer w0.203: 8,2.35 7.45,2.35 5.51,4.29 5.51,6.48 4.95,7.04 4.45,7.04 U5.1
  Top Layer w0.254: U5.1 1.72,7.01 1.07,7.66 1.07,16.84 1.74,17.51 U17.27
PWR_BAT: length 68.1
  Top Layer w0.254: 6.62,7.04 6.62,8.16 C17.1 ; 6.62,7.04 v1(7.34,7.76) ; 6.62,7.04 6.62,7.01 ; R1.1 22.62,1.89 21.42,1.89 21.11,2.2 v1(21.11,3.88)
  Top Layer w1.27: 7.65,10.36 8.42,10.36 9.44,9.34 ; v1(9.44,7.55) v1(9.44,8.17) v1(9.44,8.78) 9.44,9.03 9.49,9.08 ; 9.59,9.19 C18.1
  Top Layer w1.5: L1.2 v1(34.34,10.58) 38.06,10.58 39.42,11.94 39.42,18.78 36.52,21.68 36.52,25.05
  Bottom Layer w0.254: v1(7.34,7.76) 8.16,6.94 9.03,6.94
  Bottom Layer w1.27: 9.44,8.57 v1(9.44,8.17) v1(9.44,7.55) 9.44,5.37 10.51,4.29 30.4,4.29 33.92,7.81 33.92,10.92 v1(33.86,10.97)
  vias: v1(33.81,10.1)
QSPI_SCLK: length 5.6
  Top Layer w0.201: U9.52 24.94,23.76 24.94,22.79 25.93,21.79 26.57,21.79 26.76,21.6 U10.6
QSPI_SD0: length 5.1
  Top Layer w0.2: U10.5 29.01,22.25 28.86,22.09 26.06,22.09 25.33,22.82 U9.53
QSPI_SD1: length 11.9
  Top Layer w0.127: U9.55 26.12,23.75
  Top Layer w0.2: U10.2 33.32,20.8 33.92,21.4 33.92,22.91 33.51,23.32 28.49,23.32 27.99,22.82 26.35,22.82 26.13,23.04 U9.55
QSPI_SD2: length 10.8
  Top Layer w0.2: U10.3 33.15,21.6 33.57,22.01 33.57,22.66 33.28,22.95 28.6,22.95 28.1,22.45 26.19,22.45 25.73,22.91 U9.54
QSPI_SD3: length 6.3
  Top Layer w0.2: U10.7 27.13,20.8 26.44,21.49 25.74,21.49 24.54,22.68 24.54,23.75 U9.51
QSPI_SS: length 16.2
  Top Layer w0.2: U9.56 27.12,23.17 27.66,23.17 28.25,23.76 33.62,23.76 34.28,23.1 34.28,20.49 33.44,19.65 33.16,19.65 U10.1
  Top Layer w0.254: R21.2 34.02,18.34 32.9,18.34 32.9,19.92 U10.1
REGN: length 16.6
  Top Layer w0.203: v1(26.85,5.37) 26.85,5.98 R2.2
  Top Layer w0.254: U1.22 26.23,14.92 C1.2 25.84,15.34 v1(26.37,15.87)
  Bottom Layer w0.203: v1(26.85,5.37) 28.2,6.71 28.2,14.03 v1(26.37,15.87)
RP_D2+: length 11.3
  Top Layer w0.177: R19.2 22.87,17.7 22.87,16.8 22.22,16.15 16.33,16.15 15.1,14.92 15.1,14.49 15.19,14.4 15.19,13.96
RP_D2-: length 11.3
  Top Layer w0.177: 14.69,13.96 14.69,14.4 14.77,14.49 14.77,15.06 16.2,16.48 22.08,16.48 22.54,16.94 22.54,17.7 R20.2
RP_LED: length 1.6
  Top Layer w0.254: U9.28 20.46,31.74 R33.1
RX_RP: length 55.1
  Top Layer w0.203: v1(25.99,27.01) 26.09,27.11 U9.7 28.43,27.11 28.59,27.27 30.23,27.27 v1(30.28,27.22) ; R28.2 33.13,47.99 33.73,47.99 34.13,47.59 34.13,43.97 34.34,43.76 v1(34.34,43.51) ; v1(6.17,30.2) 5.15,31.22 4.33,31.22 U17.17
  Bottom Layer w0.203: v1(6.17,30.2) 6.17,28.77 8.06,26.88 21.35,26.88 22.3,27.84 25.22,27.84 25.99,27.07 v1(25.99,27.01) ; v1(30.28,27.22) 30.16,27.22 30.04,27.34 30.04,28.36 32.59,30.91 32.59,35.5 34.13,37.05 34.13,43.05 34.34,43.26 v1(34.34,43.51)
STAT: length 7.1
  Top Layer w0.203: LED1.1 21.57,6.82 21.57,9.03 21.75,9.21 22.36,9.21 23.19,10.03 U1.4
TS: length 2.8
  Top Layer w0.127: U1.11 27.23,7.92 27.49,7.66 ; 27.49,7.66 28.1,7.04 R3.2 ; 27.49,7.66 26.93,7.1 R2.1
TX_RP: length 56.4
  Top Layer w0.203: U17.15 3.37,32.8 5.79,32.8 v1(5.84,32.75) ; v1(29.46,26.76) 29.41,26.71 U9.6 27.46,26.69 26.69,26.69 v1(26.32,26.32) ; R29.2 33.22,47.64 33.59,47.64 33.78,47.45 33.78,43.97 33.61,43.8 v1(33.61,43.51)
  Bottom Layer w0.203: v1(33.61,43.51) 33.61,43.22 33.78,43.05 33.78,37.19 32.23,35.65 32.23,31.06 29.68,28.51 29.68,27.49 29.48,27.29 29.48,26.78 v1(29.46,26.76) ; v1(5.84,32.75) 5.63,32.55 5.63,28.59 7.71,26.52 21.75,26.52 22.55,27.33 24.84,27.33 25.84,26.32 v1(26.32,26.32)
UART0_RX: length 27.7
  Top Layer w0.203: 27.48,25.51 26.18,25.51 v1(26.01,25.69) ; v1(5.49,21.57) 4.34,21.57 U17.23
  Bottom Layer w0.203: v1(5.49,21.57) 5.49,23.96 7.19,25.66 25.99,25.66 v1(26.01,25.69)
UART0_TX: length 25.1
  Top Layer w0.203: v1(25.96,24.85) 26.23,25.11 U9.2 ; v1(7.08,24.22) 5.87,24.22 4.97,25.13 U17.21
  Bottom Layer w0.203: v1(7.08,24.22) 7.94,25.08 25.73,25.08 v1(25.96,24.85)
USB_SEL: length 11.5
  Top Layer w0.203: U14.9 16.19,11.82 16.52,11.48 18.36,11.48 18.51,11.63 18.51,12.3 19,12.78 R13.2 19.46,12.78 v1(19.94,12.3) ; U1.24 24.92,12.5 21.83,12.5 v1(21.62,12.71)
  Bottom Layer w0.203: v1(21.62,12.71) 20.35,12.71 v1(19.94,12.3)
VUSB: length 32.9
  Top Layer w0.254: U14.10 17.08,13.29 C19.2 17.57,13.78 18.95,13.78 ; 17.8,9.93 17.79,9.94 ; 21.76,11.48 19.6,13.65 R13.1
  Top Layer w0.508: USB1.A4B9 12.95,7.03 12.95,9.14 v1(13.16,9.34) 13.16,12.91 11.1,14.97 U17.30 ; v1(17.8,9.9) 17.79,9.89 17.79,7 ; 24.58,11.68 22.71,11.68 22.5,11.47 C9.2 21.76,11.48 19.33,11.48 17.79,9.94
  Bottom Layer w0.508: v1(13.16,9.34) 17.24,9.34 v1(17.8,9.9)
XIN: length 10.8
  Top Layer w0.127: U9.20 24.53,31.64 24.79,31.91 24.79,34.66 25.16,35.03 25.16,37.43 25.25,37.52 25.27,37.52 26.29,38.53
  Top Layer w0.254: C35.1 26.46,38.37 26.29,38.53
XOUT: length 4.6
  Top Layer w0.127: U9.21 24.13,31.65 24.51,32.03 R24.1
$1N1438: length 4
  Top Layer w0.254: R24.2 23.65,36.39 U12.3 22.02,36.83 C36.2
$1N3021: length 4.2
  Top Layer w0.177: U9.46 22.55,23.74 22.55,21.35 21.94,20.74 R20.1
$1N3026: length 4.2
  Top Layer w0.177: R19.1 23.47,20.79 22.93,21.33 U9.47
$1N4810: length 20.6
  Top Layer w0.2: 36.01,34.08 35.19,33.26 35.19,32.6 34.04,31.45 34.04,31.44 33.67,31.07 32.44,31.07 31.57,30.2 31.57,25.66 32.54,24.69 33.92,24.69 34.58,24.03 34.58,19.77 R21.1
  Top Layer w0.203: 36.01,34.08 36.01,35.15 35.91,35.25
$1N5167: length 24.4
  Top Layer w0.203: v1(21.47,33) 21.47,32.29 22.13,31.63 U9.26 ; v1(30.19,38.92) 30.67,39.39 35.47,39.39 35.91,39.84
  Top Layer w0.254: 37.66,37.54 35.91,39.3 35.91,39.84
  Bottom Layer w0.203: v1(21.47,33) 21.57,32.9 v1(25.81,32.9) 28.43,35.53 29.5,35.53 29.83,35.85 29.83,38.55 v1(30.19,38.92)
$1N11331: length 1.9
  Top Layer w0.203: U1.10 26.72,8.37 26.72,7.76 25.88,6.92 R9.2
$1N11347: length 1.4
  Top Layer w0.254: R1.2 LED1.2
$1N11360: length 3.7
  Top Layer w0.254: U4.8 38.56,28.8 38.59,28.82 40.29,28.82 R12.2 R11.1
$1N13969: length 2.9
  Top Layer w0.254: 14.47,9.8 14.47,9.22 14.13,8.88 14.13,7.01 USB1.A5
$1N13971: length 3.1
  Top Layer w0.254: 16.41,9.8 17.14,9.07 17.14,7
$1N37377: length 1.5
  Top Layer w0.254: U15.30 30.39,47.13 R29.1
$1N37378: length 1.7
  Top Layer w0.254: R28.1 31.72,48.41 31.26,47.95 30.38,47.95 U15.31
$1N37488: length 1.6
  Top Layer w0.254: U15.5 18.4,48.13 R30.2
$1N37542: length 1.7
  Top Layer w0.254: R31.2 27.64,41.29 U15.22
$1N43548: length 1.5
  Top Layer w0.254: LED2.2 20.25,40.45 R32.2
$1N43695: length 1.3
  Top Layer w0.254: R33.2 20.12,33.87 LED3.2

## Copper pours and planes (outline as drawn; the poured copper is in the pictures)
3V3 on Top Layer: 35.96,33.41 37.18,33.41 37.18,28.67 35.96,28.67
3V3 on Inner2: -3.88,56.62 46.36,56.62 46.36,-3.31 -3.88,-3.31
GND on Top Layer: 36.77,7.4 38.2,7.4 38.2,6.02 36.77,6.02
GND on Top Layer: 31.88,30.76 35.5,30.76 35.5,25 31.88,25
GND on Top Layer: -8.52,63.25 47.58,63.25 47.58,-7.34 -8.52,-7.34
GND on Top Layer: 38.43,30.88 39.95,30.88 39.95,29.23 38.43,29.23
GND on Top Layer: 28.07,12.6 30.5,12.6 30.5,10.89 28.07,10.89
GND on Top Layer: 38.51,25.84 39.86,25.84 39.86,24.51 38.51,24.51
GND on Top Layer: 34.99,13.62 37.64,13.62 37.64,11.79 34.99,11.79
GND on Bottom Layer: -11.93,65.34 51.56,65.34 51.56,-6.52 -11.93,-6.52
GND on Inner1: -2.75,58.56 46.67,58.56 46.67,-1.83 -2.75,-1.83
PWR_BAT on Top Layer: 28.07,11.28 31.82,11.28 31.82,9.89 28.07,9.89
PWR_BAT on Top Layer: 35.75,27.45 37.28,27.45 37.28,24.95 35.75,24.95
$1N11266 on Top Layer: 27.09,15.51 33.24,15.51 33.24,11.84 27.09,11.84
$1N11288 on Top Layer: 26.59,15.36 27.95,15.36 27.95,12.5 26.59,12.5
$1N11369 on Top Layer: 35.19,27.96 36.52,27.96 36.52,26.07 35.19,26.07
$1N11371 on Top Layer: 35.19,30.02 36.52,30.02 36.52,28.16 35.19,28.16

## Text on the board
Bottom Silkscreen Layer: ESP32 IO | POWER | I2C | ESP_UART | Support for ADC | GND | IO7 | IO6 | IO5 | IO4 | SCL | SDA | TXE | RXE | TX0 | RX0 | BAT | PW_TG | RP18 | RP19 | RP20 | RP21 | RP22 | RP23 | RP24 | RP25 | RP26A | RP27A | RP28A | RP29A | 3V3 | VUSB | RST | BOOT | RP2040 | Designed: DragonzaS | ESP32 | +BAT-
Top Silkscreen Layer: POWER TOGGLE | CHG | IO1 | IO17 | Handy Pico
